# EAGLE design PMM (EAGLE 9.6.2)
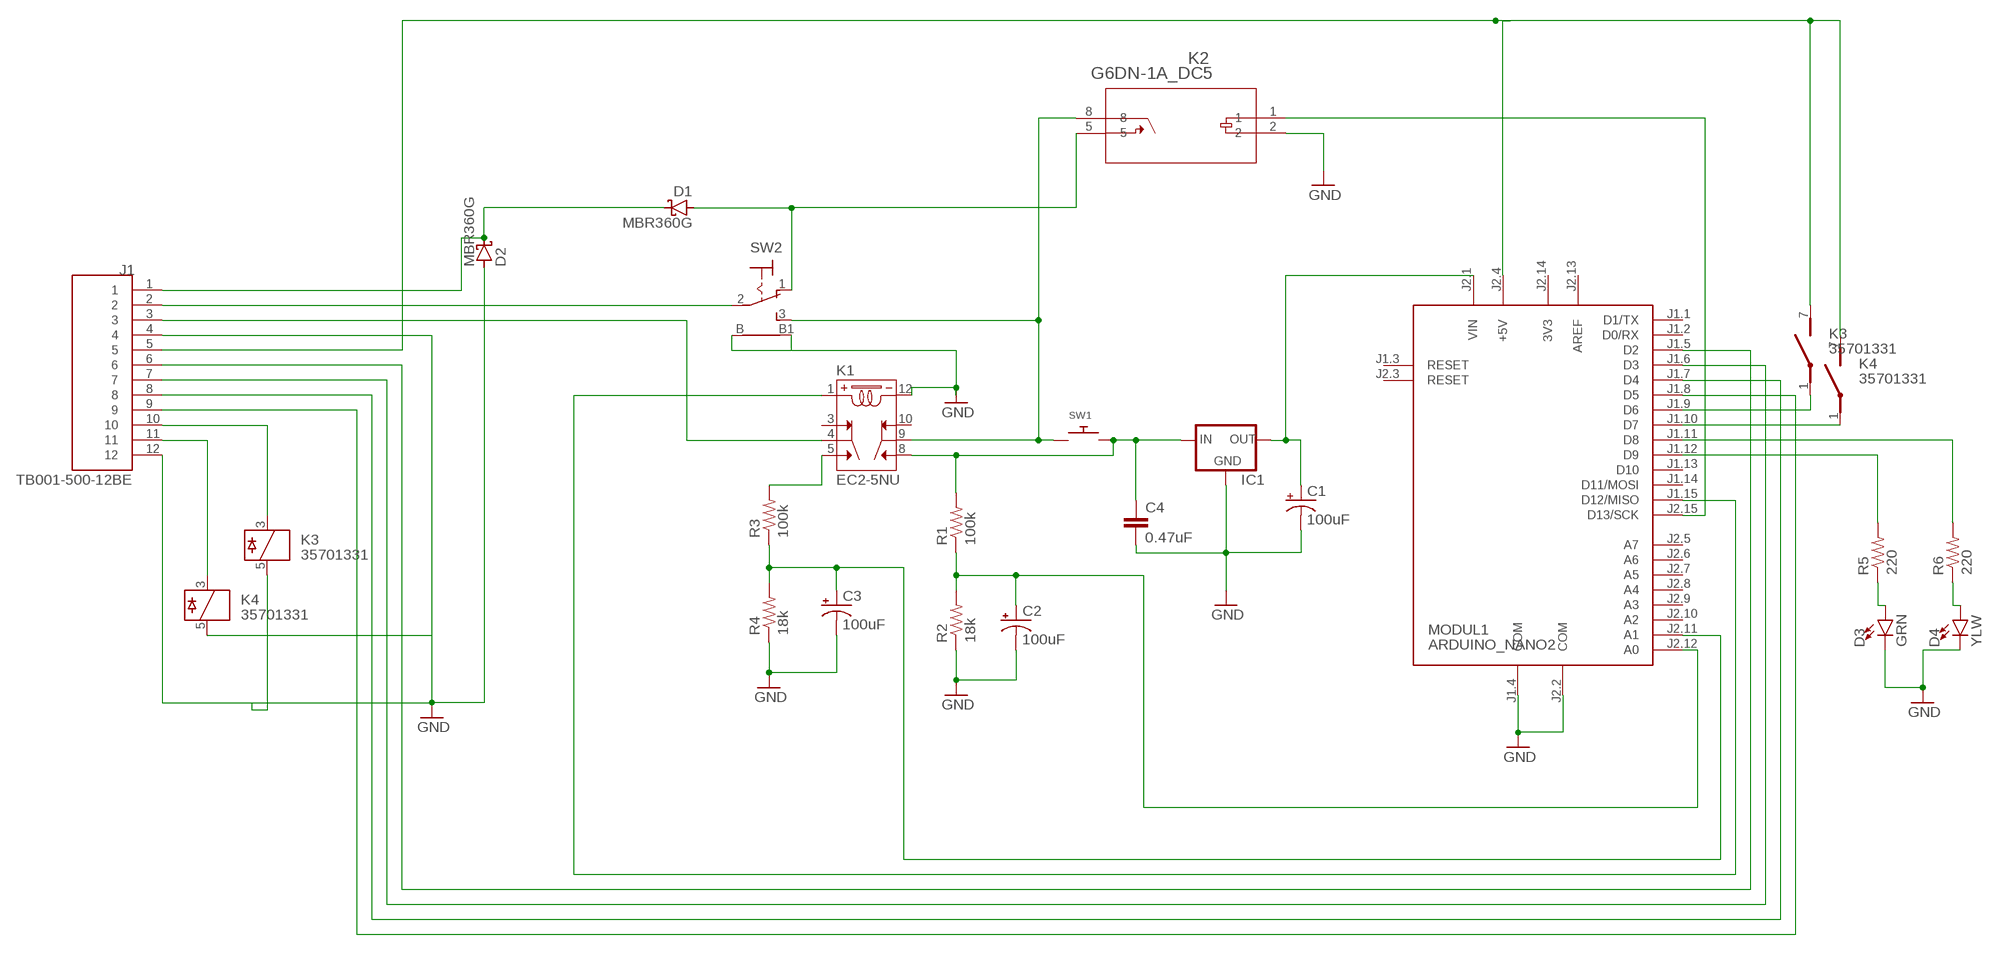
[diagram p0: schematic, sheet 1]

## Parts
C1  100uF  CPOL-USE2.5-7  [E2,5-7]
C2  100uF  CPOL-USE2.5-7  [E2,5-7]
C3  100uF  CPOL-USE2.5-7  [E2,5-7]
C4  0.47uF  C10/6  [C10B6]
D1  MBR360G  [DO201AD]
D2  MBR360G  [DO201AD]
D3  GRN  LED5MM-KIT  [LED_5MM-KIT]
D4  YLW  LED5MM-KIT  [LED_5MM-KIT]
IC1  78XXS  [78XXS]
J1  TB001-500-12BE  [CUI_TB001-500-12BE]
K1  EC2-5NU  [RELAY_EC2-5NU]
K2  G6DN-1A_DC5  [RELAY_G6DN-1A_OMR]
K3  35701331  [REED]
K4  35701331  [REED]
MODUL1  ARDUINO_NANO2  [ARDUINO_NANO2]
R1  100k  R-US_0207/12  [0207/12]
R2  18k  R-US_0207/12  [0207/12]
R3  100k  R-US_0207/12  [0207/12]
R4  18k  R-US_0207/12  [0207/12]
R5  220  R-US_0207/12  [0207/12]
R6  220  R-US_0207/12  [0207/12]
SW1  SWITCH_PUSHBUTTONON-MOM.2  [TACT_PANA-EVQ]
SW2  M20130M2013S2A2W30  [M201*30]

## Nets
GND: C1.- C2.- C3.- C4.2 D2.A D3.K(C) D4.K(C) IC1.GND J1.4 J1.12 K1.12 K2.2 K3.5 K4.5 MODUL1.J1.4(COM) MODUL1.J2.2(COM) R2.1 R4.1 SW2.B SW2.B1
N$1: J1.2 SW2.2(P)
N$2: D1.A K2.5 SW2.1(O)
N$3: K1.9 K2.8 SW1.P$1 SW2.3(S)
N$4: C4.1 IC1.IN K1.8 R1.2 SW1.P$2
N$5: K2.1 MODUL1.J2.15(D13/SCK)
N$6: D4.A R6.1
N$7: J1.3 K1.4
N$8: C2.+ MODUL1.J2.12(A0) R1.1 R2.2
N$9: D1.C D2.C J1.1
N$10: C1.+ IC1.OUT MODUL1.J2.1(VIN)
N$11: C3.+ MODUL1.J2.11(A1) R3.1 R4.2
N$12: K1.5 R3.2
N$13: J1.5 K3.7(2:S) K4.7(2:S) MODUL1.J2.4(+5V)
N$14: J1.6 MODUL1.J1.5(D2)
N$15: J1.7 MODUL1.J1.6(D3)
N$16: J1.8 MODUL1.J1.7(D4)
N$17: J1.9 MODUL1.J1.8(D5)
N$18: J1.10 K3.3
N$19: K3.1(2:P) MODUL1.J1.9(D6)
N$20: J1.11 K4.3
N$21: K4.1(2:P) MODUL1.J1.10(D7)
N$22: K1.1 MODUL1.J1.15(D12/MISO)
N$23: D3.A R5.1
N$24: MODUL1.J1.11(D8) R6.2
N$25: MODUL1.J1.12(D9) R5.2
Unconnected: K1.3 K1.10 MODUL1.J1.1(D1/TX) MODUL1.J1.2(D0/RX) MODUL1.J1.3(RESET) MODUL1.J1.13(D10) MODUL1.J1.14(D11/MOSI) MODUL1.J2.3(RESET) MODUL1.J2.5(A7) MODUL1.J2.6(A6) MODUL1.J2.7(A5) MODUL1.J2.8(A4) MODUL1.J2.9(A3) MODUL1.J2.10(A2)

## Power pins joined to a net without a drawn wire
3V3: MODUL1.J2.14(3V3)
AREF: MODUL1.J2.13(AREF)

## Library data of the parts
C1-C3 = adafruit:CPOL-US: POLARIZED CAPACITOR, American symbol
C4 = capacitor-wima:C: CAPACITOR naming: grid - package width
D1 D2 = Diodes:MBR360G: DIODE SCHOTTKY 60V 3A DO201AD Manufacturer's datasheet <https://www.onsemi.com/pub/Collateral/MBR350-D.PDF>; CREATED_BY: PCBLayout.com; DIGIKEY_PART_NUMBER: MBR360GOS-ND; MANUFACTURER: ON Semiconductor; MPN: MBR360G; PACKAGE: DO-201AD
D3 D4 = SparkFun-LED:LED: LED (Generic) Standard schematic elements and footprints for 5mm, 3mm, 1206, and 0603 sized LEDs. Generic LEDs with no color specified.
IC1 = v-reg:78XXS: VOLTAGE REGULATOR
J1 = TB001-500-12BE:TB001-500-12BE; MANUFACTURER: CUI; STANDARD: Manufacturer Recommendations
K1 = EC2-5NU:EC2-5NU: Electromechanical Relay DPDT 2A 5VDC 178Ohm Through Hole; DESCRIPTION: General Purpose Relay DPDT (2 Form C) Through Hole; DIGI-KEY_PART_NUMBER: 399-11052-5-ND; MF: KEMET; MP: EC2-5NU; PACKAGE: None; PURCHASE-URL: https://pricing.snapeda.com/search/part/EC2-5NU/?ref=eda
K2 = G6DN:G6DN-1A_DC5; BUILT_BY: EMA_Justin; COPYRIGHT: Copyright (C) 2018 Accelerated Designs. All rights reserved; MANUFACTURER_PART_NUMBER: G6DN-1A DC5; SOURCELIBRARY: Omron_2020-03-12; VENDOR: Omron
K3 K4 = relay:35701331: RELAY reed, 1 x norm. open with polarity; OC_FARNELL: unknown; OC_NEWARK: unknown
MODUL1 = arduino:ARDUINO_NANO2: Arduino Nano2 Auto generated by modulcreator.ulp \;; ANZAHL: 2; MODUL: TRUE; STECKX0: -76200; STECKX1: 76200; STECKY0: 177800; STECKY1: 177800
R1-R6 = adafruit:R-US_: RESISTOR, American symbol
SW1 = JWM:SWITCH_PUSHBUTTON: Pushbutton, OFF-MOM, SPST-NO 3A, 120V Through hole, 0.200" pitch TE ALCOSWITCH PMS9P1B10M2QE DIGIKEY 450-2063-ND
SW2 = JWM:M201*30: TOGGLE SWITCH NKK M2013S2A2W30

## Board
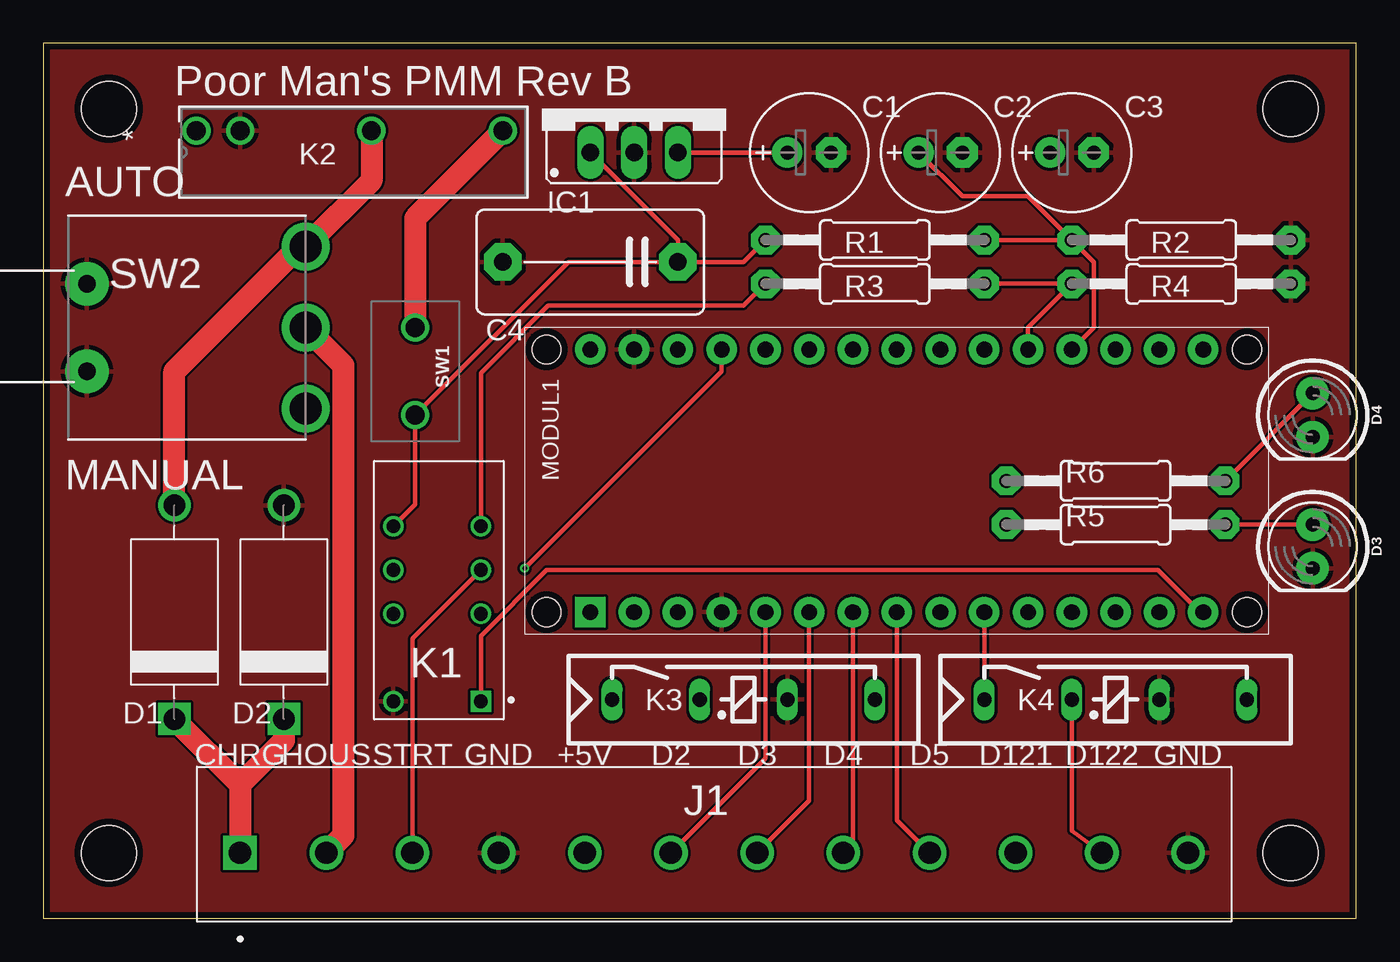
[diagram p1: board, top side]
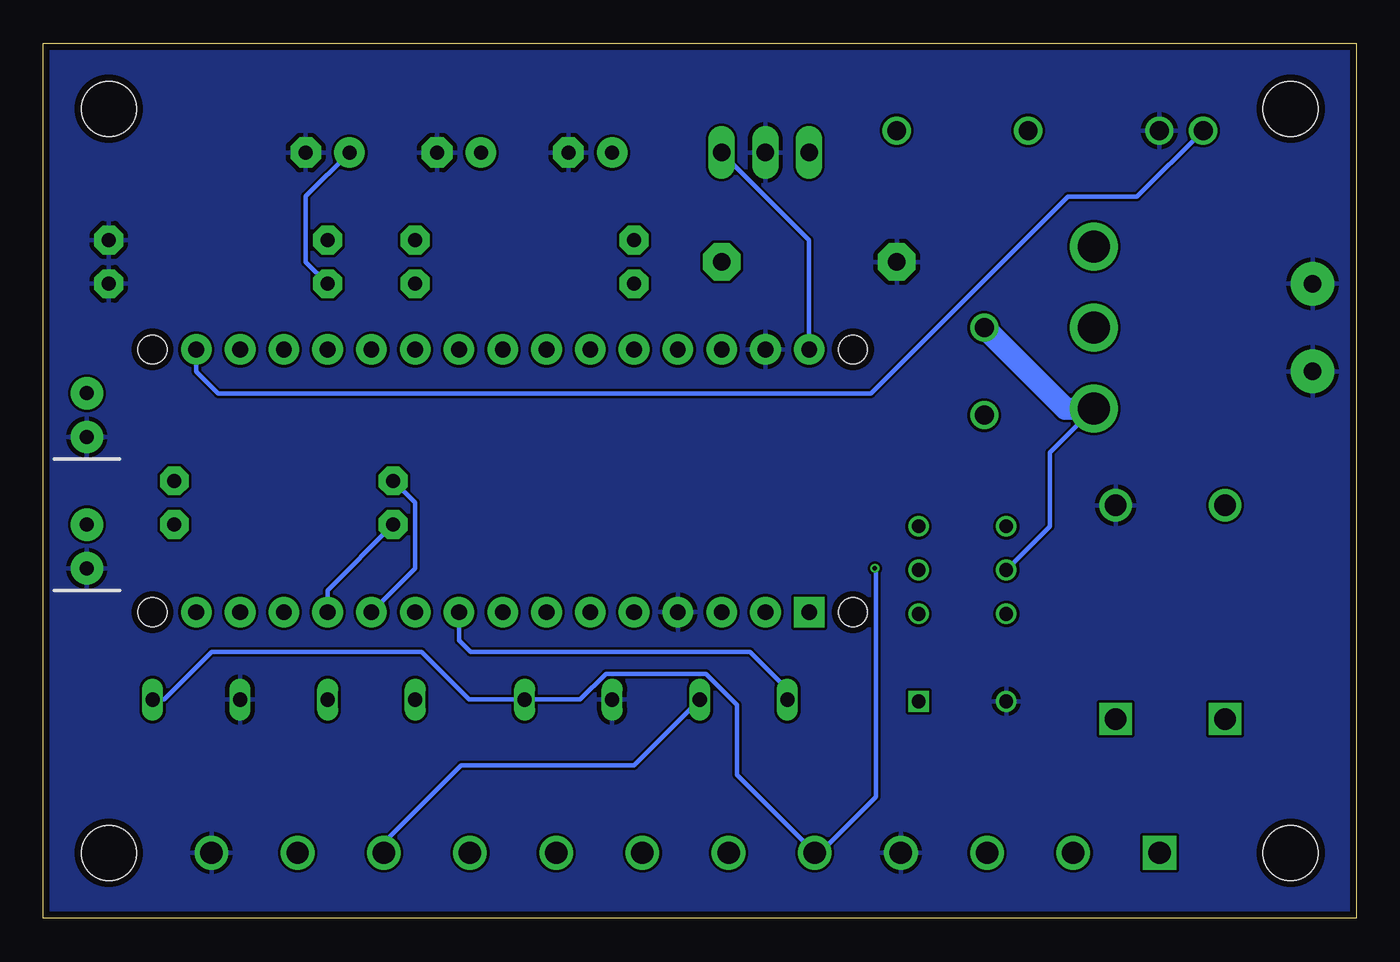
[diagram p2: board, bottom side, seen from below]

Size 76.2 x 50.8 mm. Coordinates in mm from the lower left corner, seen from the top.
Outline: 0,0 76.18,0 76.2,50.8 0,50.8 0,0
Copper layers (1*16): Top 0.035559375mm / dielectric 1.6mm / Bottom 0.035559375mm
Design rules "oshpark-2layer": minimum track width 6mil, minimum drill 10mil, track to track 6mil, track to pad 6mil, pad to pad 6mil, via to via 6mil, smd to smd 6mil, copper to edge 15mil, drill to drill 6mil, minimum pad ring 5mil, minimum via ring 5mil, stop-mask expansion 2.5mil, vias tented up to drill 0mil, thermal gap 10mil
Holes 3.17 mm at 3.81,46.99 3.81,3.81 72.39,46.99 72.39,3.81

### Footprints (pad centres in the part's own frame; a part is rotated, then mirrored left to right if it is on the bottom)
E2,5-7 = drill 0.813 pad 1.778: + -1.27,0 | drill 0.813 pad 1.778 octagon: - 1.27,0
C10B6 = drill 1.016 pad 2.159 octagon: 1 -5.08,0; 2 5.08,0
DO201AD = drill 1.25: A 6.2,0 | drill 1.25 square: C -6.2,0
LED_5MM-KIT = drill 0.813 pad 1.88: A -1.27,0; K 1.27,0
78XXS = drill 1.016 long: GND 0,-2.54; IN -2.54,-2.54; OUT 2.54,-2.54
CUI_TB001-500-12BE = drill 1.3 square: 1 0,0 | drill 1.3: 2 5,0; 3 10,0; 4 15,0; 5 20,0; 6 25,0; 7 30,0; 8 35,0; 9 40,0; 10 45,0; 11 50,0; 12 55,0
RELAY_EC2-5NU = drill 0.8 pad 1.2 square: 1 -2.54,6.45 | drill 0.8 pad 1.2: 3 -2.54,1.37; 4 -2.54,-1.17; 5 -2.54,-3.71; 8 2.54,-3.71; 9 2.54,-1.17; 10 2.54,1.37; 12 2.54,6.45
RELAY_G6DN-1A_OMR = drill 1.092 pad 1.6: 1 0,0; 2 0,-2.54; 5 0,-10.16; 8 0,-17.78
REED = drill 0.813 long: 1 -17.78,2.54; 3 -12.7,2.54; 5 -7.62,2.54; 7 -2.54,2.54
ARDUINO_NANO2 = drill 0.914 pad 1.778 square: J1.1 -7.62,17.78 | drill 0.914 pad 1.778: J1.2 -7.62,15.24; J1.3 -7.62,12.7; J1.4 -7.62,10.16; J1.5 -7.62,7.62; J1.6 -7.62,5.08; J1.7 -7.62,2.54; J1.8 -7.62,0; J1.9 -7.62,-2.54; J1.10 -7.62,-5.08; J1.11 -7.62,-7.62; J1.12 -7.62,-10.16; J1.13 -7.62,-12.7; J1.14 -7.62,-15.24; J1.15 -7.62,-17.78; J2.1 7.62,17.78; J2.2 7.62,15.24; J2.3 7.62,12.7; J2.4 7.62,10.16; J2.5 7.62,7.62; J2.6 7.62,5.08; J2.7 7.62,2.54; J2.8 7.62,0; J2.9 7.62,-2.54; J2.10 7.62,-5.08; J2.11 7.62,-7.62; J2.12 7.62,-10.16; J2.13 7.62,-12.7; J2.14 7.62,-15.24; J2.15 7.62,-17.78 | hole 1.651: -7.62,-20.32; 7.62,-20.32; 7.62,20.32; -7.62,20.32
0207/12 = drill 0.813 pad 1.676 octagon: 1 -6.35,0; 2 6.35,0
TACT_PANA-EVQ = drill 1.092: P$1 -2.54,0; P$2 2.54,0
M201*30 = drill 1.854: 1 12.7,4.699; 2 12.7,0; 3 12.7,-4.699 | drill 1.016 pad 2.54: B 0,-2.54; B1 0,2.54

### Placement (x,y rotation side)
C1  44.45,44.45 0 top
C2  52.07,44.45 0 top
C3  59.69,44.45 0 top
C4  31.75,38.1 180 top
D1  7.62,17.78 90 top
D2  13.97,17.78 90 top
D3  73.66,21.59 270 top
D4  73.66,29.21 270 top
IC1  34.29,46.99 0 top
J1  11.43,3.81 0 top
K1  22.86,19.05 180 top
K2  8.89,45.72 90 top
K3  50.8,10.16 0 top
K4  72.39,10.16 0 top
MODUL1  49.53,25.4 90 top
R1  48.26,39.37 180 top
R2  66.04,39.37 180 top
R3  48.26,36.83 180 top
R4  66.04,36.83 180 top
R5  62.23,22.86 180 top
R6  62.23,25.4 180 top
SW1  21.59,31.75 270 top
SW2  2.54,34.29 0 top

### Tracks (layer width: path | path; a pad name or v marks a point on that pad's centre or on a via)
GND
  pour Top: 0,0 0,50.8 76.2,50.8 76.2,0
  pour Bottom: 0,0 0,50.8 76.2,50.8 76.2,0
N$1
  Top 1.27: J1.2 17.42,4.8 17.42,32.11 SW2.2
N$2
  Top 1.27: K2.5 19.05,42.8 SW2.1 14.86,38.99 7.62,31.75 D1.A
N$3
  Top 1.27: K2.8 21.59,40.64 SW1.P$1
  Bottom 0.254: K1.9 17.78,22.76 17.78,27.05 SW2.3
  Bottom 1.27: SW1.P$1 16.89,29.59 SW2.3
N$4
  Top 0.254: K1.8 21.59,24.03 SW1.P$2 30.48,38.1 C4.1 | C4.1 36.83,39.37 IC1.IN | C4.1 40.64,38.1 R1.2
N$5
  Bottom 0.254: MODUL1.J2.15 67.31,31.74 66.04,30.47 28.16,30.47 16.75,41.88 12.73,41.88 K2.1
N$6
  Top 0.254: R6.1 D4.A
N$7
  Top 0.254: K1.4 21.43,16.25 J1.3
N$8
  Top 0.254: R1.1 R2.2 | R2.2 60.96,38.1 60.96,34.29 MODUL1.J2.12 | R2.2 57.15,41.91 53.34,41.91 C2.+
N$9
  Top 1.27: D1.C 11.43,7.77 | 11.43,7.77 J1.1 | D2.C 13.97,10.31 11.43,7.77
N$10
  Top 0.254: C1.+ IC1.OUT
  Bottom 0.254: IC1.OUT 31.75,39.37 MODUL1.J2.1
N$11
  Top 0.254: R3.1 R4.2 57.15,34.29 MODUL1.J2.11
  Bottom 0.254: C3.+ 60.96,41.91 60.96,38.1 R4.2
N$12
  Top 0.254: R3.2 40.64,35.56 29.31,35.56 25.4,31.65 K1.5
N$13  (via drill 0.25 pad 0.51)
  Top 0.254: MODUL1.J2.4 39.37,31.75 v27.94,20.32
  Bottom 0.254: v27.94,20.32 27.88,20.26 27.88,7.07 31.13,3.81 J1.5 35.94,8.32 35.94,12.41 37.73,14.2 43.55,14.2 45.05,12.7 K3.7 51.47,12.7 54.24,15.47 66.41,15.47 69.18,12.7 K4.7
N$14
  Top 0.254: MODUL1.J1.5 41.91,9.29 J1.6
N$15
  Top 0.254: MODUL1.J1.6 44.45,6.83 J1.7
N$16
  Top 0.254: MODUL1.J1.7 46.99,3.81 J1.8
N$17
  Top 0.254: MODUL1.J1.8 49.53,5.71 J1.9
N$18
  Bottom 0.254: K3.3 41.93,8.87 51.95,8.87 56.43,4.39 J1.10
N$19
  Bottom 0.254: MODUL1.J1.9 52.07,16.13 51.41,15.47 35.19,15.47 33.02,13.3 K3.1
N$20
  Top 0.254: J1.11 59.69,5.08 K4.3
N$21
  Top 0.254: MODUL1.J1.10 K4.1
N$22
  Top 0.152: MODUL1.J1.15 67.11,17.78
  Top 0.254: K1.1 25.4,16.41 29.21,20.22 64.67,20.22 67.11,17.78
N$23
  Top 0.254: R5.1 D3.A
N$24
  Bottom 0.254: R6.2 54.61,24.13 54.61,20.32 MODUL1.J1.11
N$25
  Bottom 0.254: R5.2 59.69,19.05 MODUL1.J1.12

### Text on the board
tPlace: Poor Man's PMM Rev B | AUTO | MANUAL | CHRG | HOUS | STRT | GND | +5V | D2 | D3 | D4 | D5 | D121 | D122 | GND